# Altium project gg_isol.PrjPCB
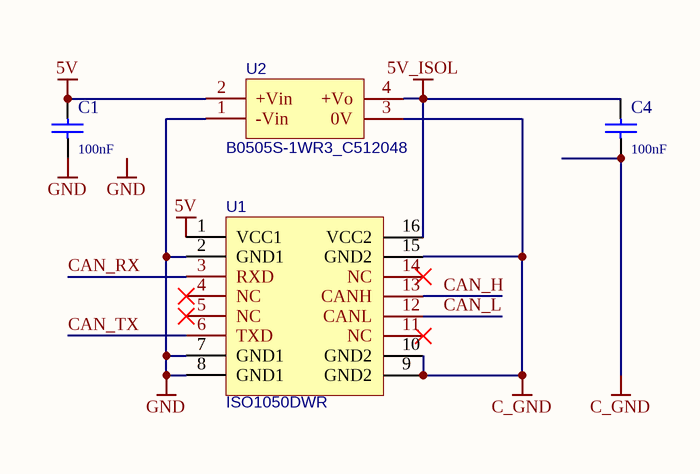
[diagram p0: board.SchDoc]
PRJ_ID: 05-03; PRJ_VER: v2.1.1
1 sheet, 4 parts. Net scope: global (net labels, ports and power ports of the same name join across sheets).
Board file: board.PcbDoc

## Sheet board.SchDoc: Display & buttons board
size A4; Revision: 1; SheetNumber: 6; SheetTotal: 29

### Parts
C1  100nF  [C0402]
C4  100nF  [C0402]
U1  ISO1050DWR  [SOIC-16_L10.3-W7.5-P1.27-LS10.3-BL]
U2  B0505S-1WR3_C512048  [PWRM-TH_BXXXXS-1WR3]

### Nets
5V: C1.2 U1.1(VCC1) U2.2(+Vin)
5V_ISOL: C4.2 U1.16(VCC2) U2.4(+Vo)
C_GND: C4.1 U1.9(GND2) U1.10(GND2) U1.15(GND2) U2.3(0V)
GND: C1.1 U1.2(GND1) U1.7(GND1) U1.8(GND1) U2.1(-Vin)
CAN_H: U1.13(CANH)
CAN_L: U1.12(CANL)
CAN_RX: U1.3(RXD)
CAN_TX: U1.6(TXD)

Not connected (* = marked no-connect by the designer): U1 4(NC)* 5(NC)* 11(NC)* 14(NC)*

### Notes on the sheet
- Labels drawn without touching a wire or pin: GND

### Library data of the parts
C1 C4 = CAP: 100nF 0402